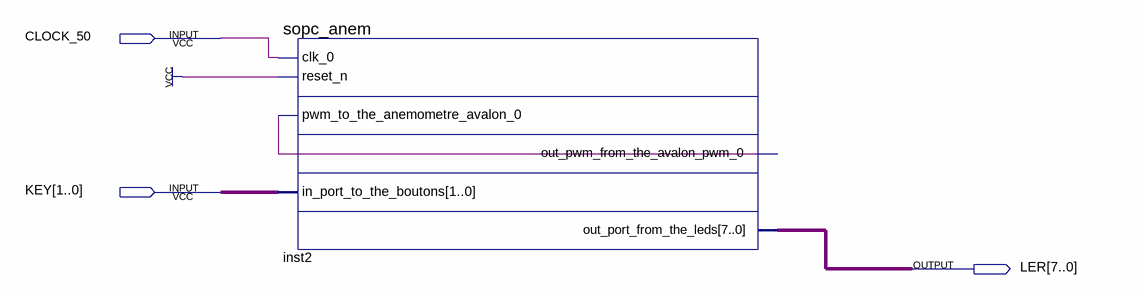
[diagram p0: schematic sheet]
// Quartus schematic sopc_anemometre.bdf as structural Verilog: 1 symbols, 3 pins
module sopc_anemometre (
  input  CLOCK_50,
  input  [1:0] KEY,
  output [7:0] LER
);

  wire inst2_out_pwm_from_the_avalon_pwm_0;

  sopc_anem inst2 (
    .clk_0(CLOCK_50), .reset_n(1'b1), .pwm_to_the_anemometre_avalon_0(inst2_out_pwm_from_the_avalon_pwm_0),
    .in_port_to_the_boutons(KEY), .out_pwm_from_the_avalon_pwm_0(inst2_out_pwm_from_the_avalon_pwm_0),
    .out_port_from_the_leds(LER));
endmodule
